# EasyEDA Pro project TMC2240-3D-Printer-Driver.epro

# Schematic tmc2240-sch-v1
Board Name: TMC2240-V1.0-4L; Create Date: 2025-01-26; Page Name: P1; Project Name: TMC2240驱动-3D打印机驱动; Schematic Name: tmc2240-sch-v1; Update Date: 2025-03-08; Company: 嘉立创EDA; Drawed: BOB; Page Size: A4; Reviewed: BOB; Version: V1.0
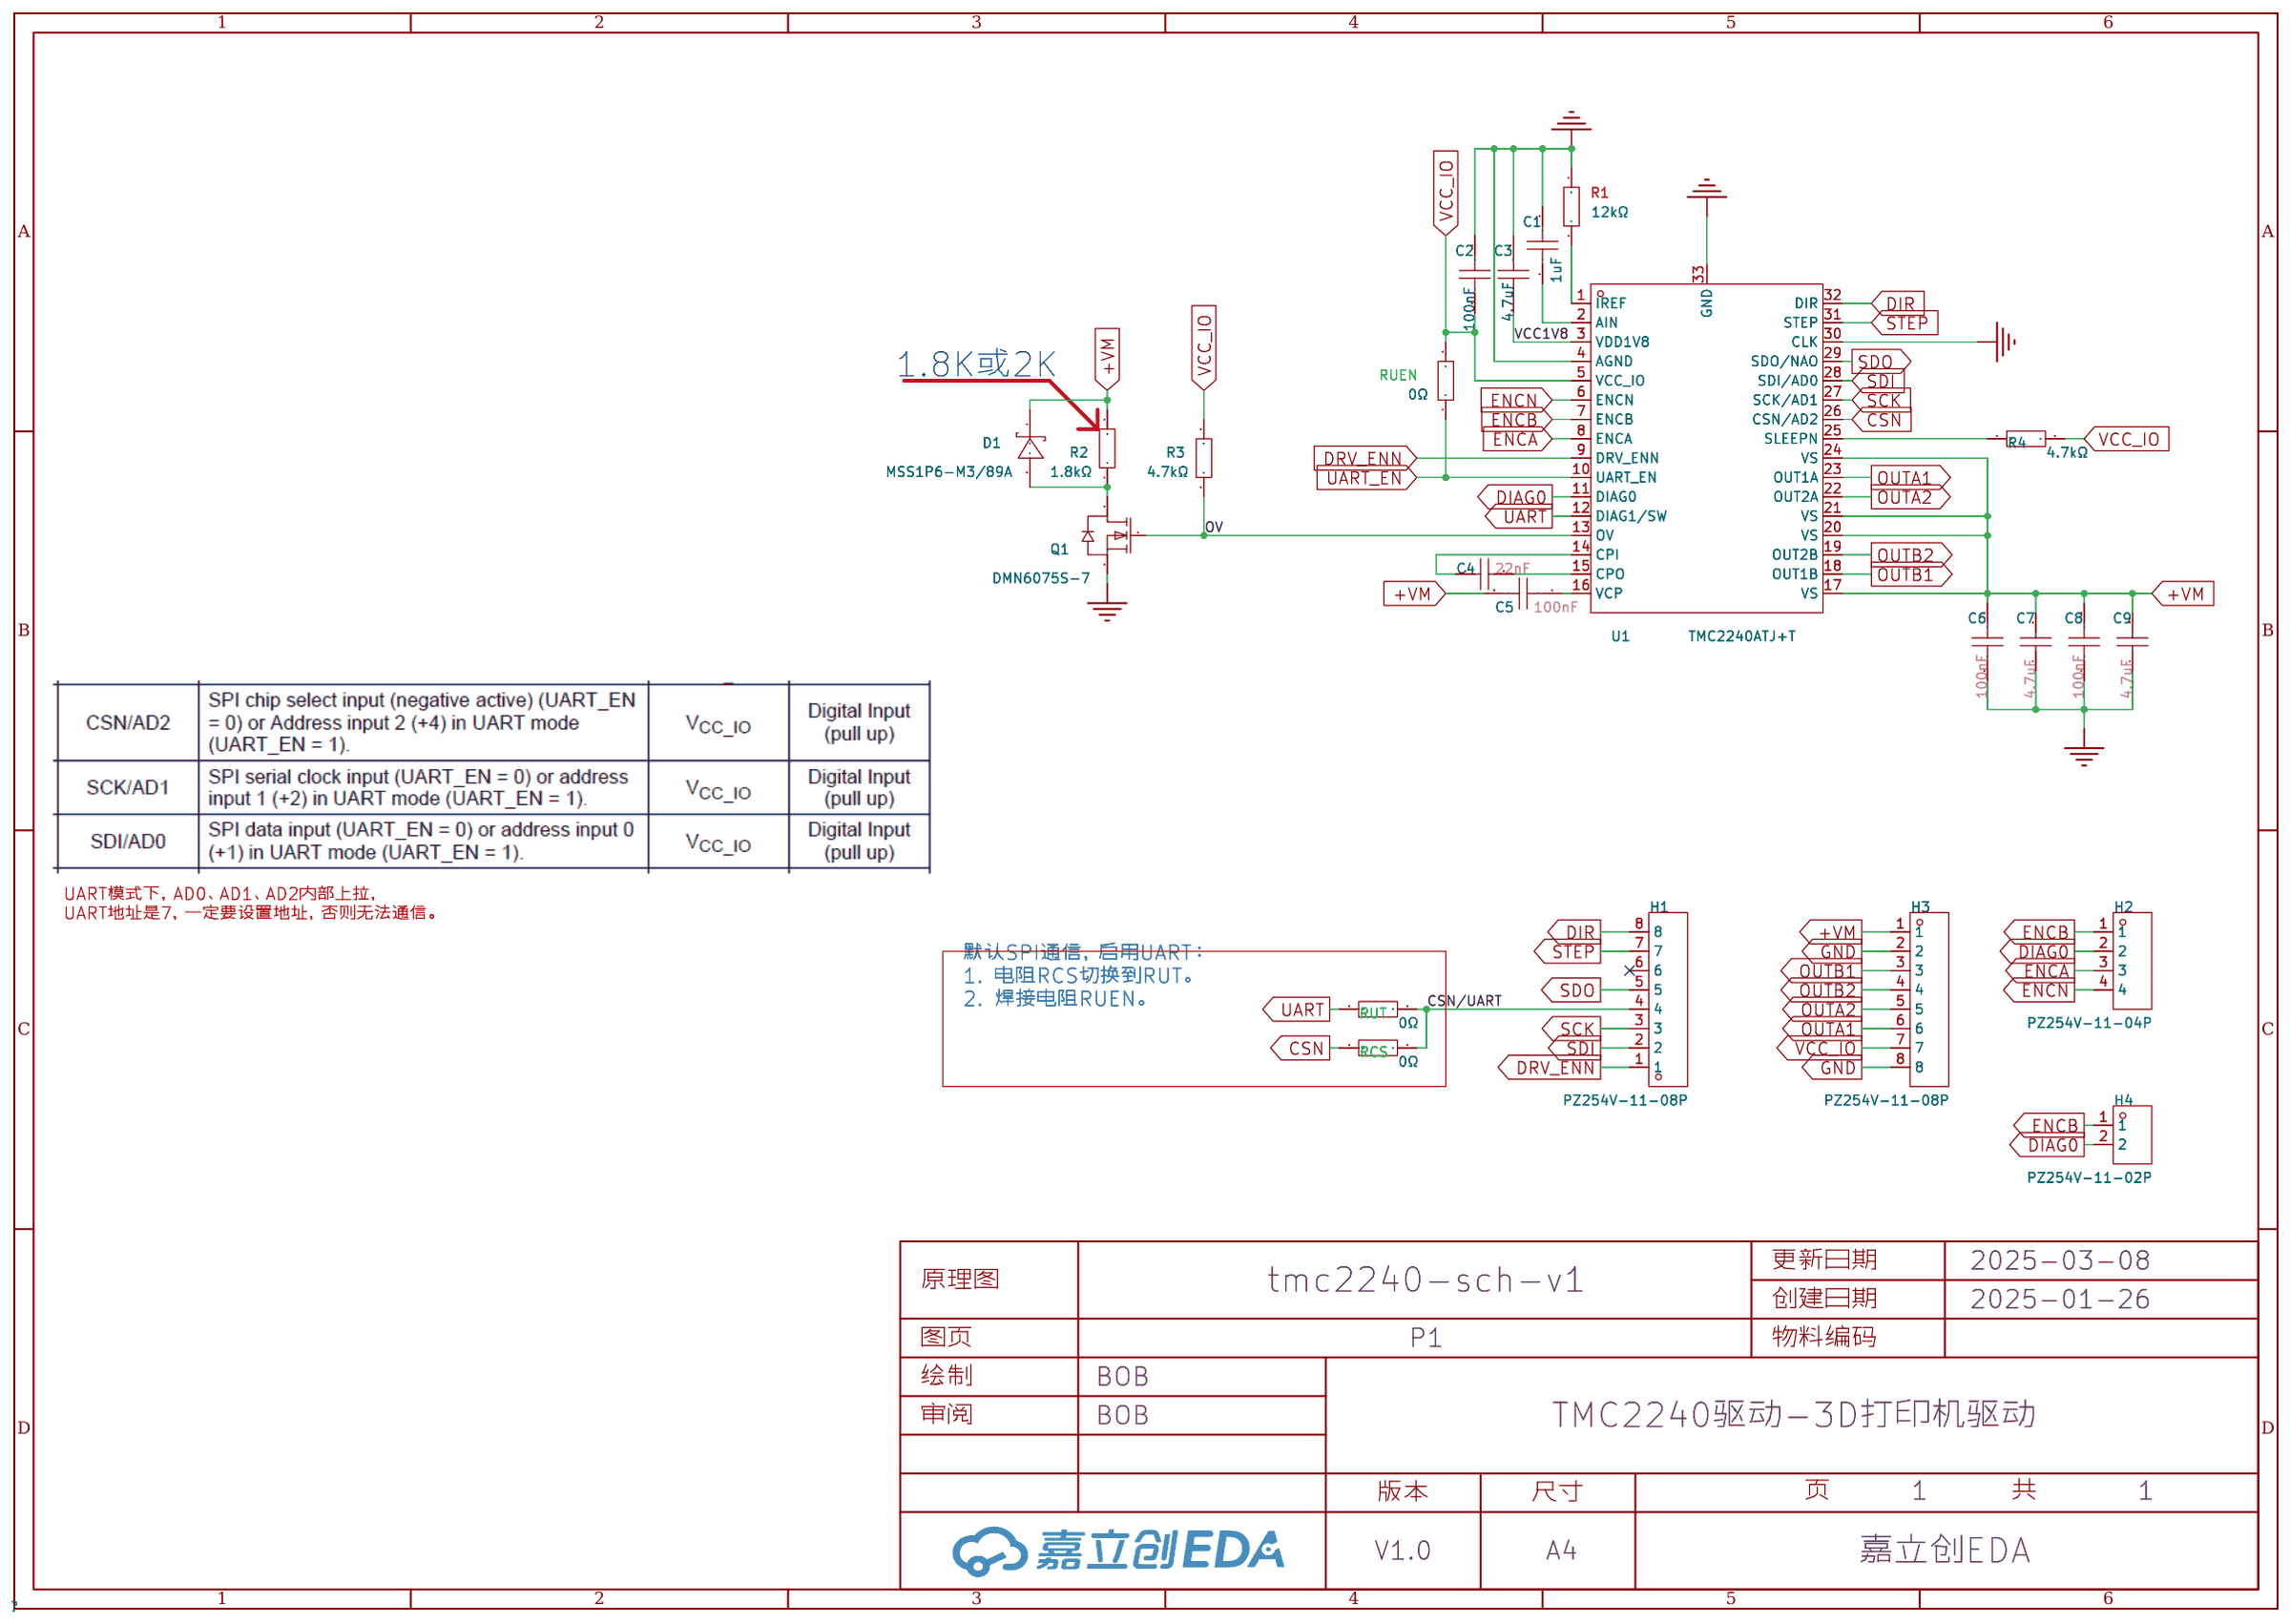
[diagram p0: schematic sheet]

## Parts
C1  1uF  [C0402]
C2  100nF  [C0402]
C3  4.7uF  [C0402]
C4  22nF  [C0402]
C5  100nF  [C0402]
C6  100nF  [C0402]
C7  4.7uF  [C0805]
C8  100nF  [C0402]
C9  4.7uF  [C0805]
D1  MSS1P6-M3/89A  [MICROSMP_L2.2-W1.3-LS2.5-RD]
H1  PZ254V-11-08P  [HDR-TH_8P-P2.54-V-M]
H2  PZ254V-11-04P  [HDR-TH_4P-P2.54-V-M]
H3  PZ254V-11-08P  [HDR-TH_8P-P2.54-V-M]
H4  PZ254V-11-02P  [HDR-TH_2P-P2.54-V-M]
Q1  DMN6075S-7  [SOT-23-3_L2.9-W1.3-P1.90-LS2.4-BR]
R1  12kΩ  [R0603]
R2  1.8kΩ  [R2512]
R3  4.7kΩ  [R0402]
R4  4.7kΩ  [R0402]
RCS  0Ω  [R0402]
RUEN  0Ω  [R0402]
RUT  0Ω  [R0402]
U1  TMC2240ATJ+T  [TQFN-32_L5.0-W5.0-P0.50-BL-EP3.5]

## Library data of the parts
C1 = CL05A105KA5NQNC: 容值:1uF;精度:±10%;额定电压:25V;材质(温度系数):X5R;; LCSC Part Name: 1uF ±10% 25V; Supplier Part: C52923; Manufacturer: SAMSUNG(三星); Supplier Footprint: 0402; JLCPCB Part Class: 基础库; Datasheet: https://atta.szlcsc.com/upload/public/pdf/source/20160218/1457707763339.pdf; Supplier: LCSC; Tolerance: ±10%; Voltage Rated: 25V; Temperature Coefficient: X5R
C2 C5 C6 C8 = CL05B104KB54PNC: 容值:100nF;精度:±10%;额定电压:50V;材质(温度系数):X7R;; LCSC Part Name: 100nF ±10% 50V; Supplier Part: C307331; Manufacturer: SAMSUNG(三星); Supplier Footprint: 0402; JLCPCB Part Class: 基础库; Datasheet: https://atta.szlcsc.com/upload/public/pdf/source/20160218/1457707763339.pdf; Supplier: LCSC; Tolerance: ±10%; Voltage Rated: 50V; Temperature Coefficient: X7R
C3 = CL05A475KP5NRNC: 容值:4.7uF;精度:±10%;额定电压:10V;材质(温度系数):X5R;; LCSC Part Name: 4.7uF ±10% 10V; Supplier Part: C368809; Manufacturer: SAMSUNG(三星); Supplier Footprint: 0402; JLCPCB Part Class: 扩展库; Datasheet: https://atta.szlcsc.com/upload/public/pdf/source/20160218/1457707763339.pdf; Supplier: LCSC; Tolerance: ±10%; Voltage Rated: 10V; Temperature Coefficient: X5R
C4 = GRM155R71H223KA12D: 容值:22nF;精度:±10%;额定电压:50V;材质(温度系数):X7R;; LCSC Part Name: 22nF ±10% 50V; Supplier Part: C77023; Manufacturer: muRata(村田); Supplier Footprint: 0402; JLCPCB Part Class: 扩展库; Datasheet: https://atta.szlcsc.com/upload/public/pdf/source/20180326/C77023_485AB0D0559A254D360F85D8E7719291.pdf; Supplier: LCSC; Tolerance: ±10%; Voltage Rated: 50V; Temperature Coefficient: X7R
C7 C9 = CL21A475KBQNNNE: 容值:4.7uF;精度:±10%;额定电压:50V;材质(温度系数):X5R;; LCSC Part Name: 4.7uF ±10% 50V; Supplier Part: C98192; Manufacturer: SAMSUNG(三星); Supplier Footprint: 0805; JLCPCB Part Class: 扩展库; Datasheet: https://atta.szlcsc.com/upload/public/pdf/source/20160218/1457707763339.pdf; Supplier: LCSC; Tolerance: ±10%; Voltage Rated: 50V; Temperature Coefficient: X5R
D1 = MSS1P6-M3/89A: 正向压降(Vf):680mV@1A;直流反向耐压(Vr):60V;平均整流电流(Io):1A;; LCSC Part Name: 电压:60V 电流:1A; Supplier Part: C2927415; Manufacturer: VISHAY(威世); Supplier Footprint: MicroSMP(DO-219AD); JLCPCB Part Class: 扩展库; Datasheet: https://atta.szlcsc.com/upload/public/pdf/source/20220608/0D8472A78EADDEC6D193A4183ACE743C.pdf; Supplier: LCSC; Forward Voltage (Vf@If): 680mV@1A; Reverse Voltage (Vr): 60V; Average Rectified Current (Io): 1A; Reverse Leakage Current (Ir): 150uA@60V
H1 H3 = PZ254V-11-08P: 插针结构:1x8P;间距:2.54mm;行距:-;圆针/方针:方针;安装类型:直插;排数:单排;总PIN位数:8P;额定电流:-;额定电压:-;配合针长度:6mm;塑高:2.5mm;端接针长度:3mm;触头材质:黄铜;触头镀层:-;工作温度范围:-40℃~+105℃;颜色:黑色;; LCSC Part Name: 间距:2.54mm 1x8P 直插 方针; Supplier Part: C492407; Manufacturer: XFCN(兴飞); Supplier Footprint: 插件,P=2.54mm; JLCPCB Part Class: 扩展库; Datasheet: https://atta.szlcsc.com/upload/public/pdf/source/20200309/C492407_83A6FB26A2233368EDB9516968EC6149.pdf; Supplier: LCSC; Pin Structure: 1x8P; Pitch: 2.54mm; Circluar Pins/Square Pins: 方针; Mounting Type: 直插; Number of Rows: 单排; Number of Pins: 8P; Length of Mating Pin: 6mm; Insulation Height: 2.5mm; Length of End Connection Pin: 3mm; Contact Material: 黄铜; Operating Temperature Range: -40℃~+105℃; Color: 黑色
H2 = PZ254V-11-04P: 插针结构:1x4P;间距:2.54mm;行距:-;圆针/方针:方针;安装类型:直插;排数:单排;总PIN位数:4P;额定电流:3A;额定电压:250V;配合针长度:6mm;塑高:2.5mm;端接针长度:3mm;触头材质:-;工作温度范围:-40℃~+105℃;颜色:黑色;; LCSC Part Name: 间距:2.54mm 1x4P 直插 方针; Supplier Part: C2691448; Manufacturer: XFCN(兴飞); Supplier Footprint: 插件,P=2.54mm; JLCPCB Part Class: 扩展库; Datasheet: https://atta.szlcsc.com/upload/public/pdf/source/20200309/C492403_F9F19131791D08044AD4F84F8E751A34.pdf; Supplier: LCSC; Pin Structure: 1x4P; Pitch: 2.54mm; Circluar Pins/Square Pins: 方针; Mounting Type: 直插; Number of Rows: 单排; Number of Pins: 4P; Current Rating (Max): 3A; Voltage Rating (Max): 250V; Length of Mating Pin: 6mm; Insulation Height: 2.5mm; Length of End Connection Pin: 3mm; Operating Temperature Range: -40℃~+105℃; Color: 黑色
H4 = PZ254V-11-02P: 插针结构:1x2P;间距:2.54mm;行距:-;圆针/方针:方针;安装类型:直插;排数:单排;总PIN位数:2P;额定电流:-;额定电压:-;配合针长度:6mm;塑高:2.5mm;端接针长度:3mm;触头材质:黄铜;触头镀层:-;工作温度范围:-40℃~+105℃;颜色:黑色;; LCSC Part Name: 间距:2.54mm 1x2P 直插 方针; Supplier Part: C492401; Manufacturer: XFCN(兴飞); Supplier Footprint: 插件,P=2.54mm; JLCPCB Part Class: 扩展库; Datasheet: https://atta.szlcsc.com/upload/public/pdf/source/20200309/C492401_A812433581A9B211A7FFA413ADDFF0E5.pdf; Supplier: LCSC; Pin Structure: 1x2P; Pitch: 2.54mm; Circluar Pins/Square Pins: 方针; Mounting Type: 直插; Number of Rows: 单排; Number of Pins: 2P; Length of Mating Pin: 6mm; Insulation Height: 2.5mm; Length of End Connection Pin: 3mm; Contact Material: 黄铜; Operating Temperature Range: -40℃~+105℃; Color: 黑色
Q1 = DMN6075S-7: 类型:1个N沟道;漏源电压(Vdss):60V;连续漏极电流(Id):2.5A;导通电阻(RDS(on)@Vgs,Id):120mΩ@4.5V,2.8A;功率(Pd):800mW;阈值电压(Vgs(th)@Id):3V@250uA;; LCSC Part Name: 1个N沟道 耐压:60V 电流:2.5A; Supplier Part: C155242; Manufacturer: DIODES(美台); Supplier Footprint: SOT-23; JLCPCB Part Class: 扩展库; Datasheet: https://atta.szlcsc.com/upload/public/pdf/source/20171221/C155242_15138396093971195986.pdf; Supplier: LCSC; Type: 1个N沟道; Drain Source Voltage (Vdss): 60V; Continuous Drain Current (Id): 2.5A; Drain Source On Resistance (RDS(on)@Vgs,Id): 120mΩ@4.5V,2.8A; Power Dissipation (Pd): 800mW; Gate Threshold Voltage (Vgs(th)@Id): 3V@250uA; Total Gate Charge (Qg@Vgs): 5.6nC@4.5V; Input Capacitance (Ciss@Vds): 606pF@20V; Reverse Transfer Capacitance (Crss@Vds): 24.6pF; Operating Temperature: -55℃~+150℃
R1 = 0603WAF1202T5E: 电阻类型:厚膜电阻;阻值:12kΩ;精度:±1%;功率:100mW;最大工作电压:75V;温度系数:±100ppm/℃;; LCSC Part Name: 12kΩ ±1% 100mW 厚膜电阻; Supplier Part: C22790; Manufacturer: UNI-ROYAL(厚声); Supplier Footprint: 0603; JLCPCB Part Class: 基础库; Datasheet: https://atta.szlcsc.com/upload/public/pdf/source/20200306/C422600_1E6D84923E4A46A82E41ADD87F860B5C.pdf; Supplier: LCSC; Type: 厚膜电阻; Tolerance: ±1%; Power(Watts): 100mW; Overload Voltage (Max): 75V; Temperature Coefficient: ±100ppm/℃; Operating Temperature Range: -55℃~+155℃
R2 = RC2512JK-071K8L: 电阻类型:厚膜电阻;阻值:1.8kΩ;精度:±5%;功率:1W;最大工作电压:200V;温度系数:±100ppm/℃;; LCSC Part Name: 厚膜电阻 1.8kΩ ±5% 1W; Supplier Part: C137011; Manufacturer: YAGEO(国巨); Supplier Footprint: 2512; JLCPCB Part Class: 扩展库; Datasheet: https://atta.szlcsc.com/upload/public/pdf/source/20180224/C181757_15194369480721363983.pdf; Supplier: LCSC; Type: 厚膜电阻; Tolerance: ±5%; Power(Watts): 1W; Overload Voltage (Max): 200V; Temperature Coefficient: ±100ppm/℃; Operating Temperature Range: -55℃~+155℃
R3 R4 = 0402WGF4701TCE: 电阻类型:厚膜电阻;阻值:4.7kΩ;精度:±1%;功率:62.5mW;最大工作电压:50V;温度系数:±100ppm/℃;; LCSC Part Name: 4.7kΩ ±1% 62.5mW 厚膜电阻; Supplier Part: C25900; Manufacturer: UNI-ROYAL(厚声); Supplier Footprint: 0402; JLCPCB Part Class: 基础库; Datasheet: https://atta.szlcsc.com/upload/public/pdf/source/20200306/C422600_1E6D84923E4A46A82E41ADD87F860B5C.pdf; Supplier: LCSC; Type: 厚膜电阻; Tolerance: ±1%; Power(Watts): 62.5mW; Overload Voltage (Max): 50V; Temperature Coefficient: ±100ppm/℃; Operating Temperature Range: -55℃~+155℃
RCS RUEN RUT = 0402WGF0000TCE: 电阻类型:厚膜电阻;阻值:0Ω;精度:±1%;功率:62.5mW;最大工作电压:50V;温度系数:±800ppm/℃;; LCSC Part Name: 0Ω ±1% 62.5mW 厚膜电阻; Supplier Part: C17168; Manufacturer: UNI-ROYAL(厚声); Supplier Footprint: 0402; JLCPCB Part Class: 基础库; Datasheet: https://atta.szlcsc.com/upload/public/pdf/source/20200306/C422600_1E6D84923E4A46A82E41ADD87F860B5C.pdf; Supplier: LCSC; Type: 厚膜电阻; Tolerance: ±1%; Power(Watts): 62.5mW; Overload Voltage (Max): 50V; Temperature Coefficient: ±800ppm/℃; Operating Temperature Range: -55℃~+155℃
U1 = TMC2240ATJ+T: Supplier Part: C7429724; Manufacturer: TRINAMIC; Supplier Footprint: 32-TQFN-EP; JLCPCB Part Class: 扩展库; Datasheet: https://atta.szlcsc.com/upload/public/pdf/source/20230619/81D3D0EE708D7E1C739CA64D0373EAAD.pdf; Supplier: LCSC

## Nets
GND: C1.2 C2.2 C3.2 C6.1 C7.1 C8.1 C9.1 H3.2 H3.8 Q1.2(S) R1.2 U1.4(AGND) U1.30(CLK) U1.33(GND)
VCC1V8: C3.1 U1.3(VDD1V8)
VCC_IO: C2.1 H3.7 R3.1 R4.2 RUEN.2 U1.5(VCC_IO)
+VM: C5.2 C6.2 C7.2 C8.2 C9.2 D1.1(A) H3.1 R2.2 U1.17(VS) U1.20(VS) U1.21(VS) U1.24(VS)
CSN: RCS.1 U1.26(CSN/AD2)
CSN/UART: H1.4 RCS.2 RUT.2
DIAG0: H2.2 H4.2 U1.11(DIAG0)
DIR: H1.8 U1.32(DIR)
DRV_ENN: H1.1 U1.9(DRV_ENN)
ENCA: H2.3 U1.8(ENCA)
ENCB: H2.1 H4.1 U1.7(ENCB)
ENCN: H2.4 U1.6(ENCN)
OUTA1: H3.6 U1.23(OUT1A)
OUTA2: H3.5 U1.22(OUT2A)
OUTB1: H3.3 U1.18(OUT1B)
OUTB2: H3.4 U1.19(OUT2B)
OV: Q1.1(G) R3.2 U1.13(OV)
SCK: H1.3 U1.27(SCK/AD1)
SDI: H1.2 U1.28(SDI/AD0)
SDO: H1.5 U1.29(SDO/NAO)
STEP: H1.7 U1.31(STEP)
UART: RUT.1 U1.12(DIAG1/SW)
UART_EN: RUEN.1 U1.10(UART_EN)
$C1_1: C1.1 U1.2(AIN)
$C4_1: C4.1 U1.14(CPI)
$C4_2: C4.2 U1.15(CPO)
$C5_1: C5.1 U1.16(VCP)
$D1_2: D1.2(K) Q1.3(D) R2.1
$R1_1: R1.1 U1.1(IREF)
$R4_1: R4.1 U1.25(SLEEPN)

Not connected (* = marked no-connect by the designer): H1 6*

## Notes on the sheet
- 1.8K或2K
- UART模式下，AD0、AD1、AD2内部上拉，
  UART地址是7，一定要设置地址，否则无法通信。
- 默认SPI通信，启用UART：
  1. 电阻RCS切换到RUT。
  2. 焊接电阻RUEN。

# Board tmc2240-pcb-v1
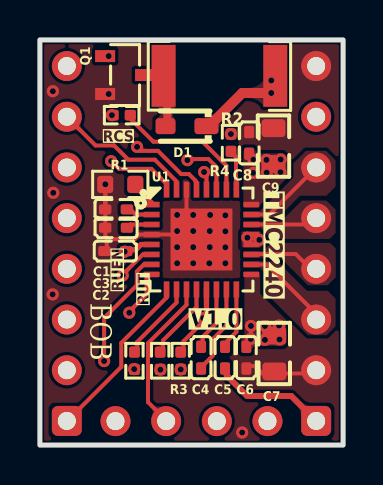
[diagram p1: board, top side]
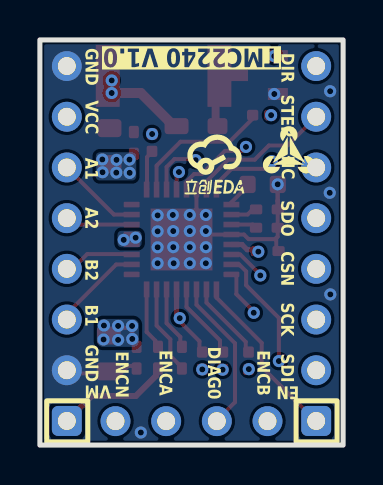
[diagram p2: board, bottom side, seen from below]

Outline 15.2 x 20.3 mm; copper layers: Top Layer, Inner1, 电源, Bottom Layer. Coordinates in mm from the lower left corner of the outline.
Outline path: rectangle 0,20.3 15.2,0
Stack: Top Layer 0.035mm 外层铜厚1oz / Dielectric1 0.2104mm 7628 RC49% 8.6mil / Inner1 0.0152mm 内层铜厚 / Dielectric2 1.065mm 1.1mm H/HOZ Copper / 电源 0.0152mm 内层铜厚 / Dielectric3 0.2104mm 7628 RC49% 8.6mil / Bottom Layer 0.035mm 外层铜厚1oz

## Design rules (mm)
template: 自定义配置
spacing copperThickness1oz (default): track to track 0.18, other pairs 0.152 to 0.25
spacing copperThickness2oz: track to track 0.203, other pairs 0.152 to 0.3
track width copperThickness1oz (default): min 0.15, default 0.2, max 2.54
track width copperThickness2oz: min 0.203, default 0.254, max 2.54
differential pair differentialPair (default): width min 0.127, default 0.254, max 2.54; gap min 0.152, default 0.152
via viaSize (default): diameter min 0.5, default 0.61, max 10; hole min 0.3, default 0.305, max 6.3

## Placement (name value [footprint] x y rotation side)
C1  1uF  [C0402]  3.82 11.81 180 top
C2  100nF  [C0402]  3.78 9.72 180 top
C3  4.7uF  [C0402]  3.82 10.89 180 top
C4  22nF  [C0402]  8.08 4.38 270 top
C5  100nF  [C0402]  9.28 4.38 270 top
C6  100nF  [C0402]  10.35 4.38 90 top
C7  4.7uF  [C0805]  11.75 4.59 90 top
C8  100nF  [C0402]  10.49 15.14 270 top
C9  4.7uF  [C0805]  11.71 14.98 270 top
D1  MSS1P6-M3/89A  [MICROSMP_L2.2-W1.3-LS2.5-RD]  7.25 15.98 180 top
H1  PZ254V-11-08P  [HDR-TH_8P-P2.54-V-M]  1.35 10.1 90 top
H2  PZ254V-11-04P  [HDR-TH_4P-P2.54-V-M]  7.6 1.2 0 top
H3  PZ254V-11-08P  [HDR-TH_8P-P2.54-V-M]  13.85 10.1 90 top
Q1  DMN6075S-7  [SOT-23-3_L2.9-W1.3-P1.90-LS2.4-BR]  4.27 18.54 180 top
R1  12kΩ  [R0603]  4.03 13.06 180 top
R2  1.8kΩ  [R2512]  9 18.5 0 top
R3  4.7kΩ  [R0402]  7.06 4.23 90 top
R4  4.7kΩ  [R0402]  9.58 15.15 90 top
RCS  0Ω  [R0402]  4.1 16.53 180 top
RUEN  0Ω  [R0402]  4.74 4.23 270 top
RUT  0Ω  [R0402]  6.03 4.23 270 top
U1  TMC2240ATJ+T  [TQFN-32_L5.0-W5.0-P0.50-BL-EP3.5]  8.1 10.3 270 top

## Footprints (pads in the part's own frame, mm; a bottom-side part is the same pattern mirrored in y, then rotated)
C0402
  rrect 0.62x0.5 smd: 1(-0.545,0) 2(0.545,0)
C0805
  rrect 0.9x1.2 smd: 1(-0.9,0) 2(0.9,0)
HDR-TH_4P-P2.54-V-M
  round 1.5 hole 0.9: 1(-3.81,0) 2(-1.27,0) 3(1.27,0) 4(3.81,0)
HDR-TH_8P-P2.54-V-M
  rrect 1.5x1.5 hole 0.9: 1(-8.89,0)
  round 1.5 hole 0.9: 2(-6.35,0) 3(-3.81,0) 4(-1.27,0) 5(1.27,0) 6(3.81,0) 7(6.35,0) 8(8.89,0)
MICROSMP_L2.2-W1.3-LS2.5-RD
  rrect 1.2x0.8 smd: 1(-1.1,0)
  rrect 1x0.8 smd: 2(0.953,0)
R0402
  rrect 0.566x0.54 smd: 1(-0.433,0) 2(0.433,0)
R0603
  rrect 0.806x0.864 smd: 1(-0.753,0) 2(0.753,0)
R2512
  rect 1.2x3.1 smd: 1(-2.8,0) 2(2.8,0)
SOT-23-3_L2.9-W1.3-P1.90-LS2.4-BR
  rect 1x0.6 smd: 1(1,-0.95) 2(1,0.95) 3(-1,0)
TQFN-32_L5.0-W5.0-P0.50-BL-EP3.5
  rect 0.28x0.8 smd: 1(-1.75,-2.5) 2(-1.25,-2.5) 3(-0.75,-2.5) 4(-0.25,-2.5) 5(0.25,-2.5) 6(0.75,-2.5) 7(1.25,-2.5) 18(1.25,2.5) 19(0.75,2.5) 20(0.25,2.5) 21(-0.25,2.5) 22(-0.75,2.5) 23(-1.25,2.5)
  rrect 0.28x0.8 smd: 8(1.75,-2.5) 17(1.75,2.5) 24(-1.75,2.5)
  rect 0.8x0.28 smd: 9(2.5,-1.75) 10(2.5,-1.25) 11(2.5,-0.75) 12(2.5,-0.25) 13(2.5,0.25) 14(2.5,0.75) 15(2.5,1.25) 16(2.5,1.75) 25(-2.5,1.75) 26(-2.5,1.25) 27(-2.5,0.75) 28(-2.5,0.25) 29(-2.5,-0.25) 31(-2.5,-1.25) 32(-2.5,-1.75)
  rrect 0.8x0.28 smd: 30(-2.5,-0.75)
  rect 3.1x3.1 smd: 33(0,0)

## Nets
As in the schematic.

Pads without a net: H1 6

## Via types
v1: diameter 0.61, hole 0.305, Top Layer to Bottom Layer, 53 vias

## Routing (per net, layer and track width the routed paths; a pad name or vN(x,y) marks a point on that pad's centre or on a via; arc(x,y) is an arc through that point)
GND: length 13.9
  Top Layer w0.2: 7.65,11.53 7.35,11.83 U1.30 ; 3.29,12.25 3.29,11.82 3.28,11.82 ; 3.29,12.25 3.28,12.24 ; 3.29,12.25 3.29,13.06 v1(3.28,13.06) 3.28,12.24 ; 3.35,10.37 3.28,10.45 3.28,11.82 ; 3.35,10.37 3.35,9.77 ; 3.35,10.37 3.41,10.32 4.74,10.32 4.97,10.55 U1.4 6.71,10.55 v1(6.88,10.72) ; 3.28,12.24 3.28,11.82 ; 3.28,12.24 3.27,12.24 C1.2 3.28,11.82 ; 10.3,3.97 10.78,3.97 11.15,3.59 13.69,3.59 H3.2
  vias: v1(0.64,7.55) v1(0.65,17.73) v1(0.67,12.64) v1(3.45,17.59) v1(6.88,11.53) v1(6.88,9.92) v1(6.88,9.11) v1(7.69,11.53) v1(7.69,10.72) v1(7.69,9.92) v1(7.69,9.11) v1(8.54,11.53) v1(8.52,10.72) v1(8.52,9.92) v1(8.49,9.11) v1(9.3,11.51) v1(9.3,10.71) v1(9.3,9.91) v1(9.3,9.11) v1(10.14,0.63)
VCC1V8: length 1.3
  Top Layer w0.2: 4.44,10.87 4.44,10.96 4.53,11.05 U1.3
VCC_IO: length 26
  Top Layer w0.26: v1(4.25,9.69) 4.35,9.79 4.81,9.79 5.07,10.05 U1.5
  Inner1 w0.3: v1(7.06,3.79) 7.06,3.34 6.72,3 5.03,3 4.73,3.3 v1(4.73,3.8) 4.73,5.05 3.41,6.37 3.41,8.85 v1(4.25,9.69)
  电源 w0.5: v1(4.25,9.69) 5,10.44 5,13.41 7.18,15.59 9.57,15.59 v1(9.57,15.58) 10.45,16.46 13.84,16.46 H3.7
$C1_1: length 1.2
  Top Layer w0.2: U1.2 4.79,11.55 4.59,11.75 4.44,11.75
$C4_1: length 3.1
  Top Layer w0.2: U1.14 8.85,6.11 8.16,5.42 8.16,5.11 8.09,5.03 8.08,5.03
$C4_2: length 4.4
  Top Layer w0.2: 8.08,3.94 8.1,3.92 8.11,3.92 8.66,4.47 8.66,5.3 9.35,5.99 U1.15
$C5_1: length 3.1
  Top Layer w0.2: U1.16 9.85,5.67 9.41,5.23 9.41,5.05 C5.1
$D1_2: length 2.6
  Top Layer w0.4: R2.1 6.39,18.31 6.39,16.07 D1.2
$R1_1: length 1.3
  Top Layer w0.2: U1.1 5.6,12.16 4.76,13 4.71,13
$R4_1: length 2
  Top Layer w0.2: 9.55,14.71 9.83,14.43 9.83,12.83 9.81,12.81
+VM: length 12.2
  Top Layer w0.2: 11.75,5.59 11.47,5.87 10.73,5.87 10.57,5.71 10.57,5.25
  Top Layer w0.3: H3.1 12.6,2.46 10.39,2.46 9.37,3.48 9.37,3.91
  Top Layer w0.5: v1(11.6,18.27) 11.6,17.71 11.53,17.64 10.14,17.64 8.48,15.98 D1.1
  vias: v1(10.4,10.39) v1(10.58,5.97) v1(10.57,5.32) v1(10.71,14.3) v1(10.7,13.64) v1(11,10.28) v1(11.28,5.97) v1(11.28,5.27) v1(11.36,14.29) v1(11.37,13.65) v1(11.6,17.64) v1(11.99,5.99) v1(12.01,5.29) v1(12.07,14.31) v1(12.06,13.67)
CSN: length 7.2
  Top Layer w0.2: RCS.1 4.53,16.36 5.69,15.2 8.15,15.2 9.35,14 U1.26
CSN/UART: length 15.7
  电源 w0.2: v1(6.04,3.78) 6.04,3.8 1.35,8.49 H1.4 1.48,8.83 2.56,9.91 2.56,15.48 v1(3.61,16.53)
DIAG0: length 7.8
  Top Layer w0.2: H2.2 6.33,1.24 5.42,2.15 5.42,5.1 7.35,7.03 U1.11
DIR: length 9.4
  Top Layer w0.2: v1(3.57,14.22) 3.77,14.03 3.78,14.03 3.97,13.84 5.59,13.84 6.35,13.08 U1.32
  Inner1 w0.2: v1(3.57,14.22) 2.56,15.24 2.56,18.06 1.63,18.99 H1.8
DRV_ENN: length 8.7
  Top Layer w0.2: H1.1 1.37,1.21 4.08,3.92 4.08,5.12 6.35,7.39 U1.9
ENCA: length 10.3
  Top Layer w0.2: v1(4.48,6.63) 4.48,6.69 5.35,7.56 5.35,8.54 5.36,8.55 U1.8
  Inner1 w0.2: v1(4.48,6.63) 5.32,6.63 8.87,3.08 H2.3
ENCB: length 9.3
  Top Layer w0.2: v1(3.22,4.21) 3.22,6.37 4.86,8.01 4.86,8.7 5.22,9.06 5.59,9.06 U1.7
  Inner1 w0.2: v1(3.22,4.21) 3.23,4.21 3.78,3.66 3.78,1.21 H2.1
ENCN: length 12.2
  Top Layer w0.2: U1.6 5.16,9.55 4.25,8.64 4.25,8.6 v1(4.15,8.5)
  Inner1 w0.2: v1(4.15,8.5) 4.17,8.5 11.41,1.26 H2.4
OUTA1: length 4.2
  Top Layer w0.2: H3.6 11.49,11.55 U1.23
OUTA2: length 3.4
  Top Layer w0.2: H3.5 13.78,11.37 13.46,11.05 U1.22
OUTB1: length 4.7
  Top Layer w0.2: H3.3 13.99,6.43 11.37,9.05 U1.18
OUTB2: length 3.6
  Top Layer w0.2: U1.19 10.62,9.57 12.83,9.57 13.57,8.83 H3.4
OV: length 23.6
  Top Layer w0.2: v1(8.19,6.36) 8.19,6.19 7.2,5.2 7.2,4.8 R3.2
  Top Layer w0.26: v1(8.19,6.36) 8.35,6.52 U1.13
  Inner1 w0.3: v1(3.45,19.49) 3.5,19.49 8.94,14.05 8.94,13.36 8.47,12.89 6.31,12.89 5.12,11.7 5.12,8.76 7.52,6.36 v1(8.19,6.36)
SCK: length 14.1
  Top Layer w0.2: U1.27 8.85,13.93 8.45,14.33 7.45,14.33 v1(7.39,14.28)
  Inner1 w0.2: v1(7.39,14.28) 7.34,14.33 6.41,14.33 2.47,10.39 2.47,7.03 1.73,6.29 H1.3
SDI: length 14.9
  Top Layer w0.2: v1(8.23,13.68) 8.29,13.68 8.35,13.62 U1.28
  Inner1 w0.2: H1.2 1.35,4.35 2.9,5.9 2.9,10.26 6.25,13.61 8.16,13.61 v1(8.23,13.68)
SDO: length 10
  Top Layer w0.2: v1(4.87,14.94) 5.07,14.74 5.92,14.74 7.08,13.58 7.47,13.58 7.8,13.25 7.8,13.22 7.85,13.17 U1.29
  Inner1 w0.2: v1(4.87,14.94) 4.87,13.35 2.88,11.36 1.36,11.36 H1.5
STEP: length 7.3
  Top Layer w0.2: U1.31 6.85,13.21 5.76,14.3 4.43,14.3 3.72,15.01 2.79,15.01 H1.7
UART: length 3.9
  Top Layer w0.2: U1.12 7.85,6.92 6.17,5.24 6.17,4.8 RUT.1
UART_EN: length 4
  Top Layer w0.2: RUEN.1 4.88,4.8 4.88,5.17 6.85,7.14 U1.10

## Copper pours and planes (outline as drawn; the poured copper is in the pictures)
GND on Top Layer: -1.48,21.09 15.4,21.09 15.4,-0.54 -1.48,-0.54
GND on Bottom Layer: -0.51,21.61 15.54,21.61 15.54,-0.43 -0.51,-0.43
GND on Inner1: 6.42,12.01 9.75,12.01 9.75,8.62 6.42,8.62
GND on Inner1: -0.42,21.11 15.49,21.11 15.49,-1.61 -0.42,-1.61
GND on 电源: 6.41,11.96 9.74,11.96 9.74,8.66 6.41,8.66
+VM on Top Layer: 10.1,8.55 12.34,8.55 12.34,4.81 10.1,4.81
+VM on Top Layer: 10.2,14.86 12.38,14.86 12.38,11.97 10.2,11.97
+VM on Bottom Layer: 10.37,14.67 12.4,14.67 12.4,13.26 10.37,13.26
+VM on Bottom Layer: 10.24,6.32 12.34,6.32 12.34,4.92 10.24,4.92
+VM on Bottom Layer: 10.1,10.74 11.31,10.74 11.31,9.91 10.1,9.91
+VM on Inner1: 10.47,18.16 10.47,10.97 10.23,10.73 10.23,3.84 12.41,1.66 12.41,0.67 12.78,0.3 14.69,0.3 14.77,0.38 14.77,2.14 14.24,2.67 13.63,2.67 12.36,3.94 12.36,18.16 11.94,18.59 10.9,18.59
+VM on 电源: -0.3,20.85 16.17,20.85 16.17,-0.92 -0.3,-0.92
OUTA1 on Top Layer: 10.27,14.74 14.82,14.74 14.82,11.39 10.27,11.39
OUTA2 on Top Layer: 10.27,12.25 14.82,12.25 14.82,10.33 10.27,10.33
OUTB1 on Top Layer: 10.28,9.21 14.82,9.21 14.82,5.51 10.28,5.51
OUTB2 on Top Layer: 10.27,10.13 14.83,10.13 14.83,8.01 10.27,8.01

Small or netless copper shapes (teardrops, artwork), in the pictures only: 82 on Top Layer, 21 on Inner1, 8 on 电源

## Text on the board
Bottom Silkscreen Layer: NC | DIR | STEP | SDO | CSN | SCK | SDI | ENCB | DIAG0 | ENCA | ENCN | GND | VCC | A1 | A2 | B2 | B1 | EN | VM | TMC2240 V1.0
Top Silkscreen Layer: TMC2240 | V1.0 | BOB
